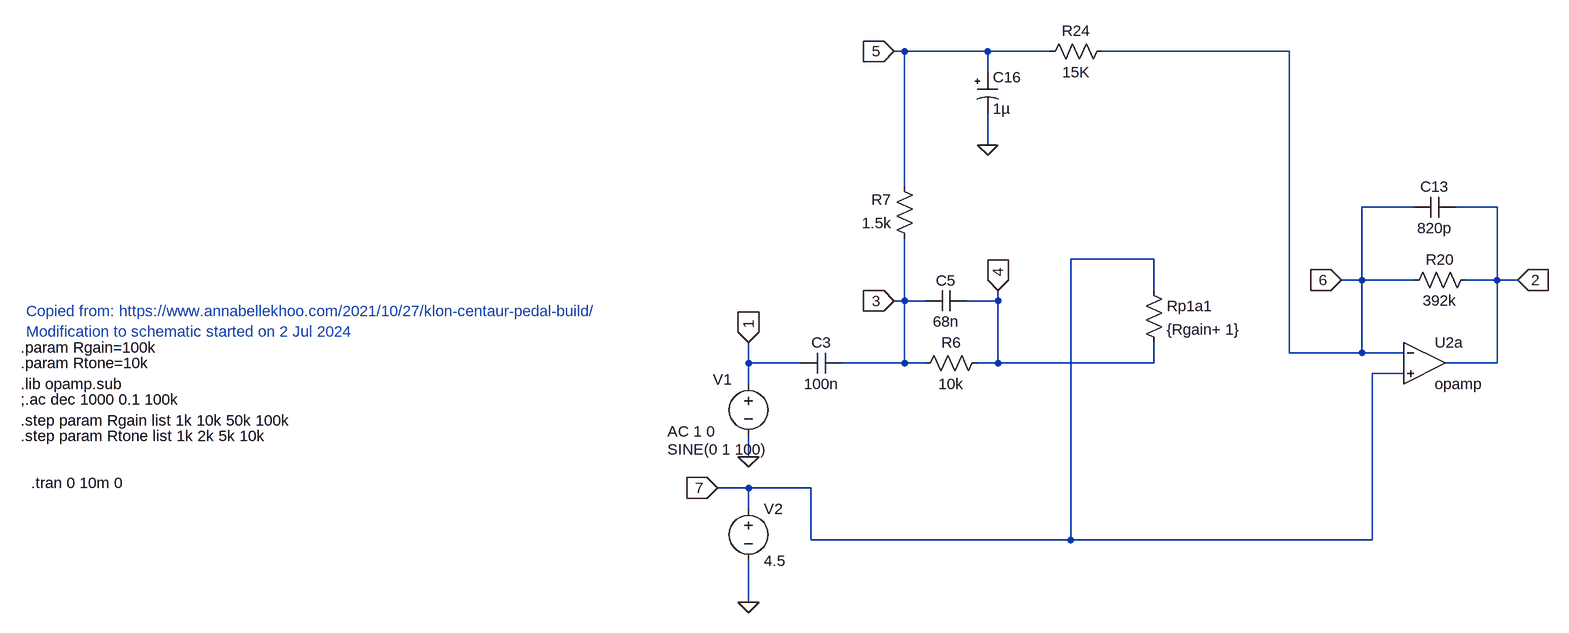
[diagram p0: schematic Klon-Centaur_sum_path_1.asc]
Klon-Centaur_sum_path_1.asc, the LTspice schematic file:
Version 4
SHEET 1 4496 5064
WIRE 96 2080 80 2080
WIRE 224 2080 96 2080
WIRE 320 2080 224 2080
WIRE 688 2080 400 2080
WIRE 224 2112 224 2080
WIRE 224 2224 224 2176
WIRE 96 2288 96 2080
WIRE 880 2320 800 2320
WIRE 1008 2320 944 2320
WIRE 480 2400 352 2400
WIRE 800 2432 800 2320
WIRE 800 2432 768 2432
WIRE 880 2432 800 2432
WIRE 1008 2432 1008 2320
WIRE 1008 2432 960 2432
WIRE 1040 2432 1008 2432
WIRE 480 2448 480 2400
WIRE 96 2464 96 2368
WIRE 96 2464 80 2464
WIRE 128 2464 96 2464
WIRE 240 2464 240 2448
WIRE 240 2464 192 2464
WIRE 688 2544 688 2080
WIRE 800 2544 800 2432
WIRE 800 2544 688 2544
WIRE 864 2544 800 2544
WIRE -144 2560 -144 2528
WIRE -64 2560 -144 2560
WIRE 96 2560 96 2464
WIRE 96 2560 0 2560
WIRE 128 2560 96 2560
WIRE 240 2560 240 2464
WIRE 240 2560 208 2560
WIRE 480 2560 480 2528
WIRE 480 2560 240 2560
WIRE 1008 2560 1008 2432
WIRE 1008 2560 928 2560
WIRE 864 2576 816 2576
WIRE -144 2592 -144 2560
WIRE -144 2704 -144 2672
WIRE -144 2752 -192 2752
WIRE -48 2752 -144 2752
WIRE -144 2784 -144 2752
WIRE -48 2832 -48 2752
WIRE 352 2832 352 2400
WIRE 352 2832 -48 2832
WIRE 816 2832 816 2576
WIRE 816 2832 352 2832
WIRE -144 2928 -144 2864
FLAG -144 2528 1
IOPIN -144 2528 In
FLAG 224 2224 0
FLAG -144 2928 0
FLAG -144 2704 0
FLAG 80 2464 3
IOPIN 80 2464 In
FLAG 80 2080 5
IOPIN 80 2080 In
FLAG 240 2448 4
IOPIN 240 2448 In
FLAG 768 2432 6
IOPIN 768 2432 In
FLAG 1040 2432 2
IOPIN 1040 2432 In
FLAG -192 2752 7
IOPIN -192 2752 In
SYMBOL voltage -144 2576 R0
WINDOW 0 -55 9 Left 2
WINDOW 123 -125 89 Left 2
WINDOW 39 0 0 Left 0
WINDOW 3 -125 117 Left 2
SYMATTR InstName V1
SYMATTR Value2 AC 1 0
SYMATTR Value SINE(0 1 100)
SYMBOL cap 0 2544 R90
WINDOW 0 0 32 VBottom 2
WINDOW 3 32 32 VTop 2
SYMATTR InstName C3
SYMATTR Value 100n
SYMBOL res 224 2544 R90
WINDOW 0 0 56 VBottom 2
WINDOW 3 32 56 VTop 2
SYMATTR InstName R6
SYMATTR Value 10k
SYMBOL cap 192 2448 R90
WINDOW 0 0 32 VBottom 2
WINDOW 3 32 32 VTop 2
SYMATTR InstName C5
SYMATTR Value 68n
SYMBOL res 464 2432 R0
SYMATTR InstName Rp1a1
SYMATTR Value {Rgain+ 1}
SYMBOL res 112 2384 R180
WINDOW 0 36 76 Left 2
WINDOW 3 36 40 Left 2
SYMATTR InstName R7
SYMATTR Value 1.5k
SYMBOL res 416 2064 R90
WINDOW 0 0 56 VBottom 2
WINDOW 3 32 56 VTop 2
SYMATTR InstName R24
SYMATTR Value 15K
SYMBOL res 976 2416 R90
WINDOW 0 0 56 VBottom 2
WINDOW 3 32 56 VTop 2
SYMATTR InstName R20
SYMATTR Value 392k
SYMBOL cap 944 2304 R90
WINDOW 0 0 32 VBottom 2
WINDOW 3 32 32 VTop 2
SYMATTR InstName C13
SYMATTR Value 820p
SYMBOL voltage -144 2768 R0
WINDOW 123 0 0 Left 0
WINDOW 39 0 0 Left 0
SYMATTR InstName V2
SYMATTR Value 4.5
SYMBOL OpAmps\\opamp 896 2496 R0
SYMATTR InstName U2a
SYMBOL polcap 208 2112 R0
SYMATTR InstName C16
SYMATTR Value 1µ
TEXT -1264 2536 Left 2 !.param Rgain=100k
TEXT -1264 2560 Left 2 !.param Rtone=10k
TEXT -1256 2480 Left 2 ;Copied from: https://www.annabellekhoo.com/2021/10/27/klon-centaur-pedal-build/\nModification to schematic started on 2 Jul 2024
TEXT -1264 2592 Left 2 !.lib opamp.sub
TEXT -1264 2616 Left 2 !;.ac dec 1000 0.1 100k
TEXT -1264 2648 Left 2 !.step param Rgain list 1k 10k 50k 100k
TEXT -1264 2672 Left 2 !.step param Rtone list 1k 2k 5k 10k
TEXT -1248 2744 Left 2 !.tran 0 10m 0

The netlist it stands for:
* Klon-Centaur_sum_path_1.asc
V1 1 0 SINE(0 1 100) AC 1 0
C3 3 1 100n
R6 4 3 10k
C5 4 3 68n
Rp1a1 7 4 {Rgain+ 1}
R7 3 5 1.5k
R24 6 5 15K
R20 2 6 392k
C13 2 6 820p
V2 7 0 4.5
XU2a 6 7 2 opamp Aol=100K GBW=10Meg  ; pins invin noninvin out
C16 5 0 1µ
.param Rgain=100k
.param Rtone=10k
* Copied from: https://www.annabellekhoo.com/2021/10/27/klon-centaur-pedal-build/
* Modification to schematic started on 2 Jul 2024
.lib opamp.sub
;.ac dec 1000 0.1 100k
.step param Rgain list 1k 10k 50k 100k
.step param Rtone list 1k 2k 5k 10k
.tran 0 10m 0
.backanno
.end